# Altium project Capstone_ADC_BREAKOUT.PrjPcb
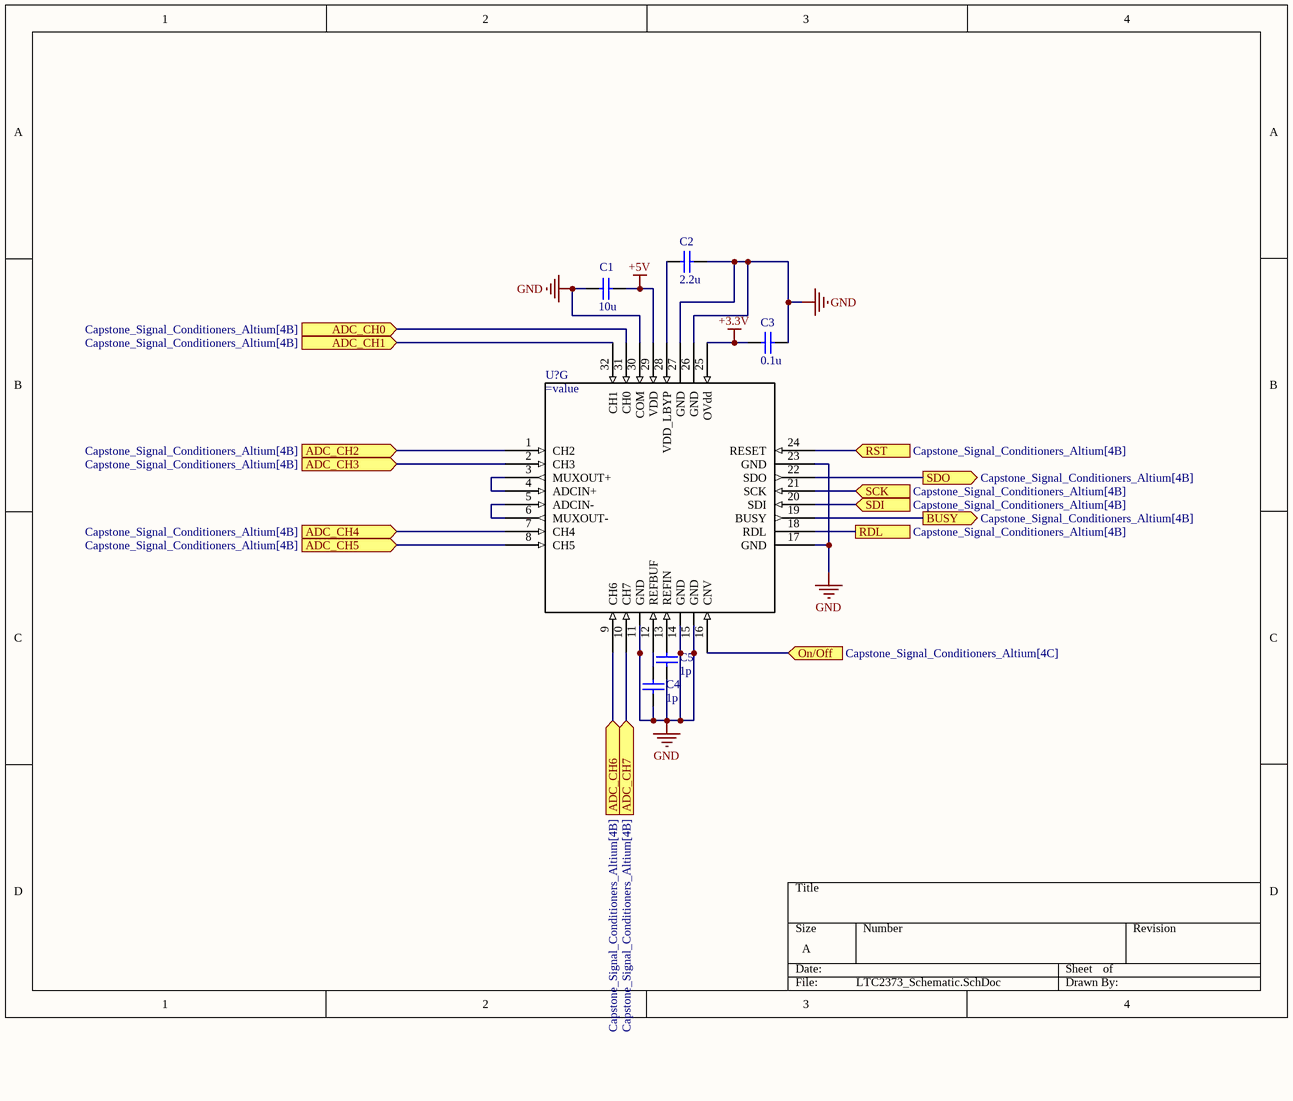
[diagram p0: LTC2373_Schematic.SchDoc]
2 sheets, 7 parts. Net scope: flat (ports and power ports of the same name join across sheets).
Board files: Capstone_ADC_Breakout.PcbDoc, ADC_PIC32_LVDS_DRIVER_Subsystem.PcbDoc
Sheets:
  LTC2373_Schematic.SchDoc
  LVDS_Driver_Subsystem.SchDoc

## Sheet LTC2373_Schematic.SchDoc
size A; SheetNumber: 4; SheetTotal: 4

### Parts
C1  value 10u  (hidden comment: Capacitor)
C2  value 2.2u  (hidden comment: Capacitor)
C3  value 0.1u  (hidden comment: Capacitor)
C4  value 1p  (hidden comment: Capacitor)
C5  value 1p  (hidden comment: Capacitor)
U?  (no value)  (part G of 7)

### Ports
ADC_CH0 (in, see Capstone_Signal_Conditioners_Altium[4B]), ADC_CH1 (in, see Capstone_Signal_Conditioners_Altium[4B]), ADC_CH2 (in, see Capstone_Signal_Conditioners_Altium[4B]), ADC_CH3 (in, see Capstone_Signal_Conditioners_Altium[4B]), ADC_CH4 (in, see Capstone_Signal_Conditioners_Altium[4B]), ADC_CH5 (in, see Capstone_Signal_Conditioners_Altium[4B]), ADC_CH6 (in, see Capstone_Signal_Conditioners_Altium[4B]), ADC_CH7 (in, see Capstone_Signal_Conditioners_Altium[4B]), BUSY (out, see Capstone_Signal_Conditioners_Altium[4B]), On/Off (in, see Capstone_Signal_Conditioners_Altium[4C]), RDL (see Capstone_Signal_Conditioners_Altium[4B]), RST (in, see Capstone_Signal_Conditioners_Altium[4B]), SCK (in, see Capstone_Signal_Conditioners_Altium[4B]), SDI (in, see Capstone_Signal_Conditioners_Altium[4B]), SDO (out, see Capstone_Signal_Conditioners_Altium[4B])

### Nets
+3.3V: C3.1 U?.25(OVdd)
+5V: C1.1 U?.29(VDD)
GND: C1.2 C2.2 C3.2 C4.1 C5.1 U?.11(GND) U?.14(GND) U?.15(GND) U?.17(GND) U?.23(GND) U?.26(GND) U?.27(GND) U?.30(COM)
NetC2_1: C2.1 U?.28(VDD_LBYP)
NetC4_2: C4.2 U?.12(REFBUF)
NetU?_1: U?.1(CH2) ; port ADC_CH2
NetU?_2: U?.2(CH3) ; port ADC_CH3
NetU?_3: U?.3(MUXOUT+) U?.4(ADCIN+)
NetU?_5: U?.5(ADCIN-) U?.6(MUXOUT-)
NetU?_7: U?.7(CH4) ; port ADC_CH4
NetU?_8: U?.8(CH5) ; port ADC_CH5
NetU?_9: U?.9(CH6) ; port ADC_CH6
NetU?_10: U?.10(CH7) ; port ADC_CH7
NetU?_16: U?.16(CNV) ; port On/Off
NetU?_18: U?.18(RDL) ; port RDL
NetU?_19: U?.19(BUSY) ; port BUSY
NetU?_20: U?.20(SDI) ; port SDI
NetU?_21: U?.21(SCK) ; port SCK
NetU?_22: U?.22(SDO) ; port SDO
NetU?_24: U?.24(RESET) ; port RST
NetU?_31: U?.31(CH0) ; port ADC_CH0
NetU?_32: U?.32(CH1) ; port ADC_CH1

Not connected (* = marked no-connect by the designer): C5 2; U? 13(REFIN)

### Library data of the parts
C1-C5 = Capacitor: SimulationGenericComponent: True
U? = LTC2372ICU-16#PBF

## Sheet LVDS_Driver_Subsystem.SchDoc
size A; SheetNumber: 5; SheetTotal: 6
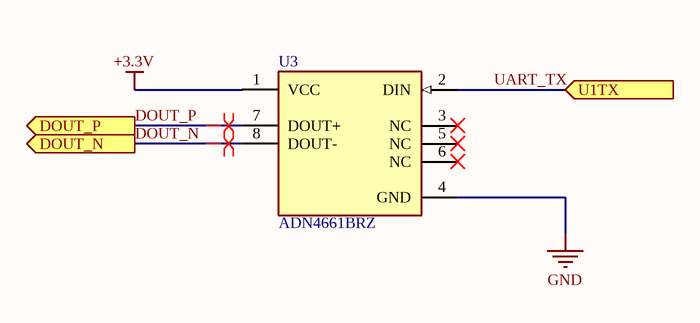
[diagram p1: LVDS_Driver_Subsystem.SchDoc]

### Parts
U3  ADN4661BRZ  [FP-R-8-IPC_A]

### Ports
DOUT_N (out), DOUT_P (out), U1TX (in)

### Nets
+3.3V: U3.1(VCC)
GND: U3.4(GND)
DOUT_N: U3.8(DOUT-) ; port DOUT_N
DOUT_P: U3.7(DOUT+) ; port DOUT_P
UART_TX: U3.2(DIN) ; port U1TX

Not connected (* = marked no-connect by the designer): U3 3(NC)* 5(NC)* 6(NC)*

### Layout directives
differential pair: DOUT_N, DOUT_P

### Library data of the parts
U3 = CMP-09093-000114-1: IC DRIVER 1/0 8SOIC; Supply Current: 7mA; Number of Receivers: 1; Min Supply Voltage: 3V; Max Supply Current: 10mA; Max Supply Voltage: 3.6V; Turn-On Delay Time: 1.5ns; Data Rate: 600Mbps; Operating Supply Voltage: 3.3V; Length: 5mm; Series: -; Number of Pins: 8; REACH SVHC: No SVHC; Mount: Surface Mount; RoHS Compliant: Yes; Packaging: Rail/Tube; Nominal Supply Current: 7mA; Radiation Hardening: No; Number of Drivers: 1; Width: 4mm; Number of Elements: 1; Lead Free: Contains Lead; Operating Supply Current: 7mA; Min Operating Temperature: -40°C; Propagation Delay: 1.5ns; Package Quantity: 98; Height: 1.5mm; Case/Package: SOIC; Max Operating Temperature: 85°C

## Nets that join several sheets
+3.3V: LTC2373_Schematic (C3.1 U?.25), LVDS_Driver_Subsystem (U3.1)
GND: LTC2373_Schematic (13 pins), LVDS_Driver_Subsystem (U3.4)